# Altium project Project_LoraE32_Transmission_V1.1.PrjPcb
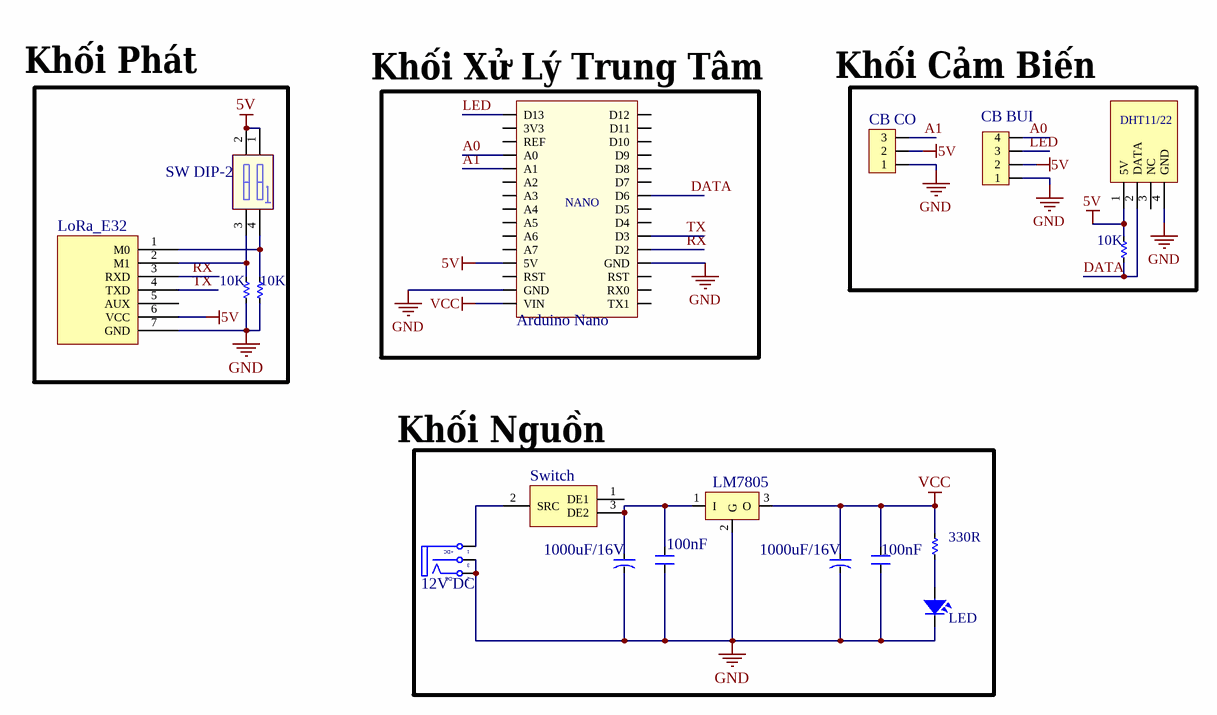
[diagram p0: Sheet_LoraE32_Transmission_V1.1.SchDoc]
SV2: Võ Đình Thịnh; SV1: Đỗ Hoàng Thắng; MSSV2: 21161201; MSSV1: 21161191; GVHD: Ths. Phan Vân Hoàn
1 sheet, 18 parts. Net scope: global (net labels, ports and power ports of the same name join across sheets).
Board file: PCB_E32_Transmission_V1.1.PcbDoc

## Sheet Sheet_LoraE32_Transmission_V1.1.SchDoc
size A4

### Parts
Arduino1  Arduino Nano  [Arduino Nano]
C2  1000uF/16V  [CAP-ALU-SMD-G]
C3  1000uF/16V  [CAP-ALU-SMD-G]
C4  100nF  [CN2]
C5  100nF  [CN2]
CB1  CB CO  [Header3]
CB2  CB BUI  [Header4]
CN1  12V DC  [DC-IN]
IC1  LM7805  [TO220H1]
L1  LoRa_E32  [LoRa_E32]
LED1  LED  [LED-0805-Green]
R1  10K  [RES-SMD-0805]
R2  10K  [RES-SMD-0805]
R4  10K  [RES-SMD-0805]
R5  330R  [RES-SMD-0805]
S1  SW DIP-2  [DIPSW2]
S2  Switch  [Switch]
SER1  DHT11/22  [DHT11_H]

### Nets
5V: Arduino1.5V CB1.2 CB2.2 L1.6(VCC) R4.1 S1.1(A1) S1.2(A2) SER1.1(5V)
GND: Arduino1.GND C2.2 C3.2 C4.1 C5.1 CB1.1 CB2.1 CN1.2(TN) CN1.3(S) IC1.2(G) L1.7(GND) LED1.2 R1.2 R2.2 S2.4 S2.5 SER1.4(GND)
VCC: Arduino1.VIN C3.1 C5.2 IC1.3(O) R5.1
A0: Arduino1.A0 CB2.4
A1: Arduino1.A1 CB1.3
DATA: Arduino1.D6 R4.2 SER1.2(DATA)
LED: Arduino1.D13 CB2.3
RX: Arduino1.D2 L1.3(RXD)
TX: Arduino1.D3 L1.4(TXD)
NetC2_1: C2.1 C4.2 IC1.1(I) S2.3(DE2)
NetCN1_1: CN1.1(T) S2.2(SRC)
NetL1_1: L1.1(M0) R2.1 S1.4(B1)
NetL1_2: L1.2(M1) R1.1 S1.3(B2)
NetLED1_1: LED1.1 R5.2

Not connected (* = marked no-connect by the designer): Arduino1 3V3 A2 A3 A4 A5 A6 A7 D4 D5 D7 D8 D9 D10 D11 D12 REF RST RX0 TX1; L1 5(AUX); S2 1(DE1); SER1 3(NC)

### Notes on the sheet
- Khối Phát
- (near Arduino1) Khối Xử Lý Trung Tâm
- Khối Cảm Biến
- (near S2) Khối Nguồn
- ĐỀ TÀI:
- ỨNG DỤNG MẠNG KHÔNG DÂY LORA TRONG HỆ THỐNG GIÁM SÁT CHẤT LƯỢNG MÔI TRƯỜNG
- SVTH:
- GVHD:
- MSSV:
- (in symbol Arduino Nano) NANO
- (in symbol DCIN) +DC; -DC

### Library data of the parts
Arduino1 = Arduino Nano: Value: Cau 1A
C2 C3 = CN-ALU-SMD: Polarized Capacitor (Axial); Published: 8-Jun-2000; LatestRevisionDate: 17-Jul-2002; LatestRevisionNote: Re-released for DXP Platform.; PackageReference: POLAR0.8; Publisher: Altium Limited
C4 C5 = CN2: Cap np 104 => 105pF; Value: 0.1uF
CB1 = Header3: Header IDC, 3 x 1 Pin Vertical 2.54mm Pitch (Non-Boxed, Male); Manufacturer: W¨¹rth Elektronik eiSos GmbH; partNo: 613002143121; ComponentLink1 Description: Manufacturer; ComponentLink2 Description: Datasheet; NoPins: 02; Created Date: 29 March 2013; ComponentLink1URL: http://www.we-online.com; ComponentLink2URL: http://katalog.we-online.de/em/datasheet/6130xx143121.pdf; Created by: Karrer Zheng
CB2 = Header4: Header IDC, 4 x 1 Pin Vertical 2.54mm Pitch (Non-Boxed, Male); Manufacturer: W¨¹rth Elektronik eiSos GmbH; partNo: 613002143121; ComponentLink1 Description: Manufacturer; ComponentLink2 Description: Datasheet; NoPins: 02; Created Date: 29 March 2013; ComponentLink1URL: http://www.we-online.com; ComponentLink2URL: http://katalog.we-online.de/em/datasheet/6130xx143121.pdf; Created by: Karrer Zheng
CN1 = DCIN: Jac DC input; Value: Jac DC
IC1 = LM78xx: Positive Voltage Regulator; Note: Tab is connected to pin 3 (GND).; Published: 24-Aug-2001; LatestRevisionDate: 17-Jul-2002; LatestRevisionNote: Re-released for DXP Platform.; DatasheetVersion: Apr-1994; PackageVersion: Jul-1998; PackageReference: ISOWATT220AB; Publisher: Altium Limited; PackageDescription: TO, Thru-Hole, Vertical, Heatsink Mounted; 3 In-Line Leads; Pitch 2.54 mm; Pin sequence 1, 3, 2; ComponentLink1Description: Manufacturer Link; ComponentLink1URL: http://www.st.com/; ComponentLink2Description: Datasheet; ComponentLink2URL: http://www.st.com/stonline/products/literature/ds/2146/l78m05c.pdf
LED1 = LED SMD: Value: LED 3 - 5 ly 2 Colour
R1 R2 R4 R5 = Res-SMD: Resistor; Manufacturer: Generic Components; Class: Passive; Published: 08/06/2000; Publisher: Altium Hobart Technology Centre
S1 = SW DIP-2: DIP Switch, 2 Position, SPST; Vendor: Digikey; Published: 24-Mar-1999; LatestRevisionDate: 17-Jul-2002; LatestRevisionNote: Re-released for DXP Platform.; PackageReference: DIP-4; Publisher: Altium Limited; ComponentLink1Description: Digikey Part Link; ComponentLink2Description: Open Datasheet; ComponentLink2URL: H:\LIBRARY\LIBRARY.Datasheet\